# EAGLE design vactrolcrossfader (EAGLE 7.6.0)
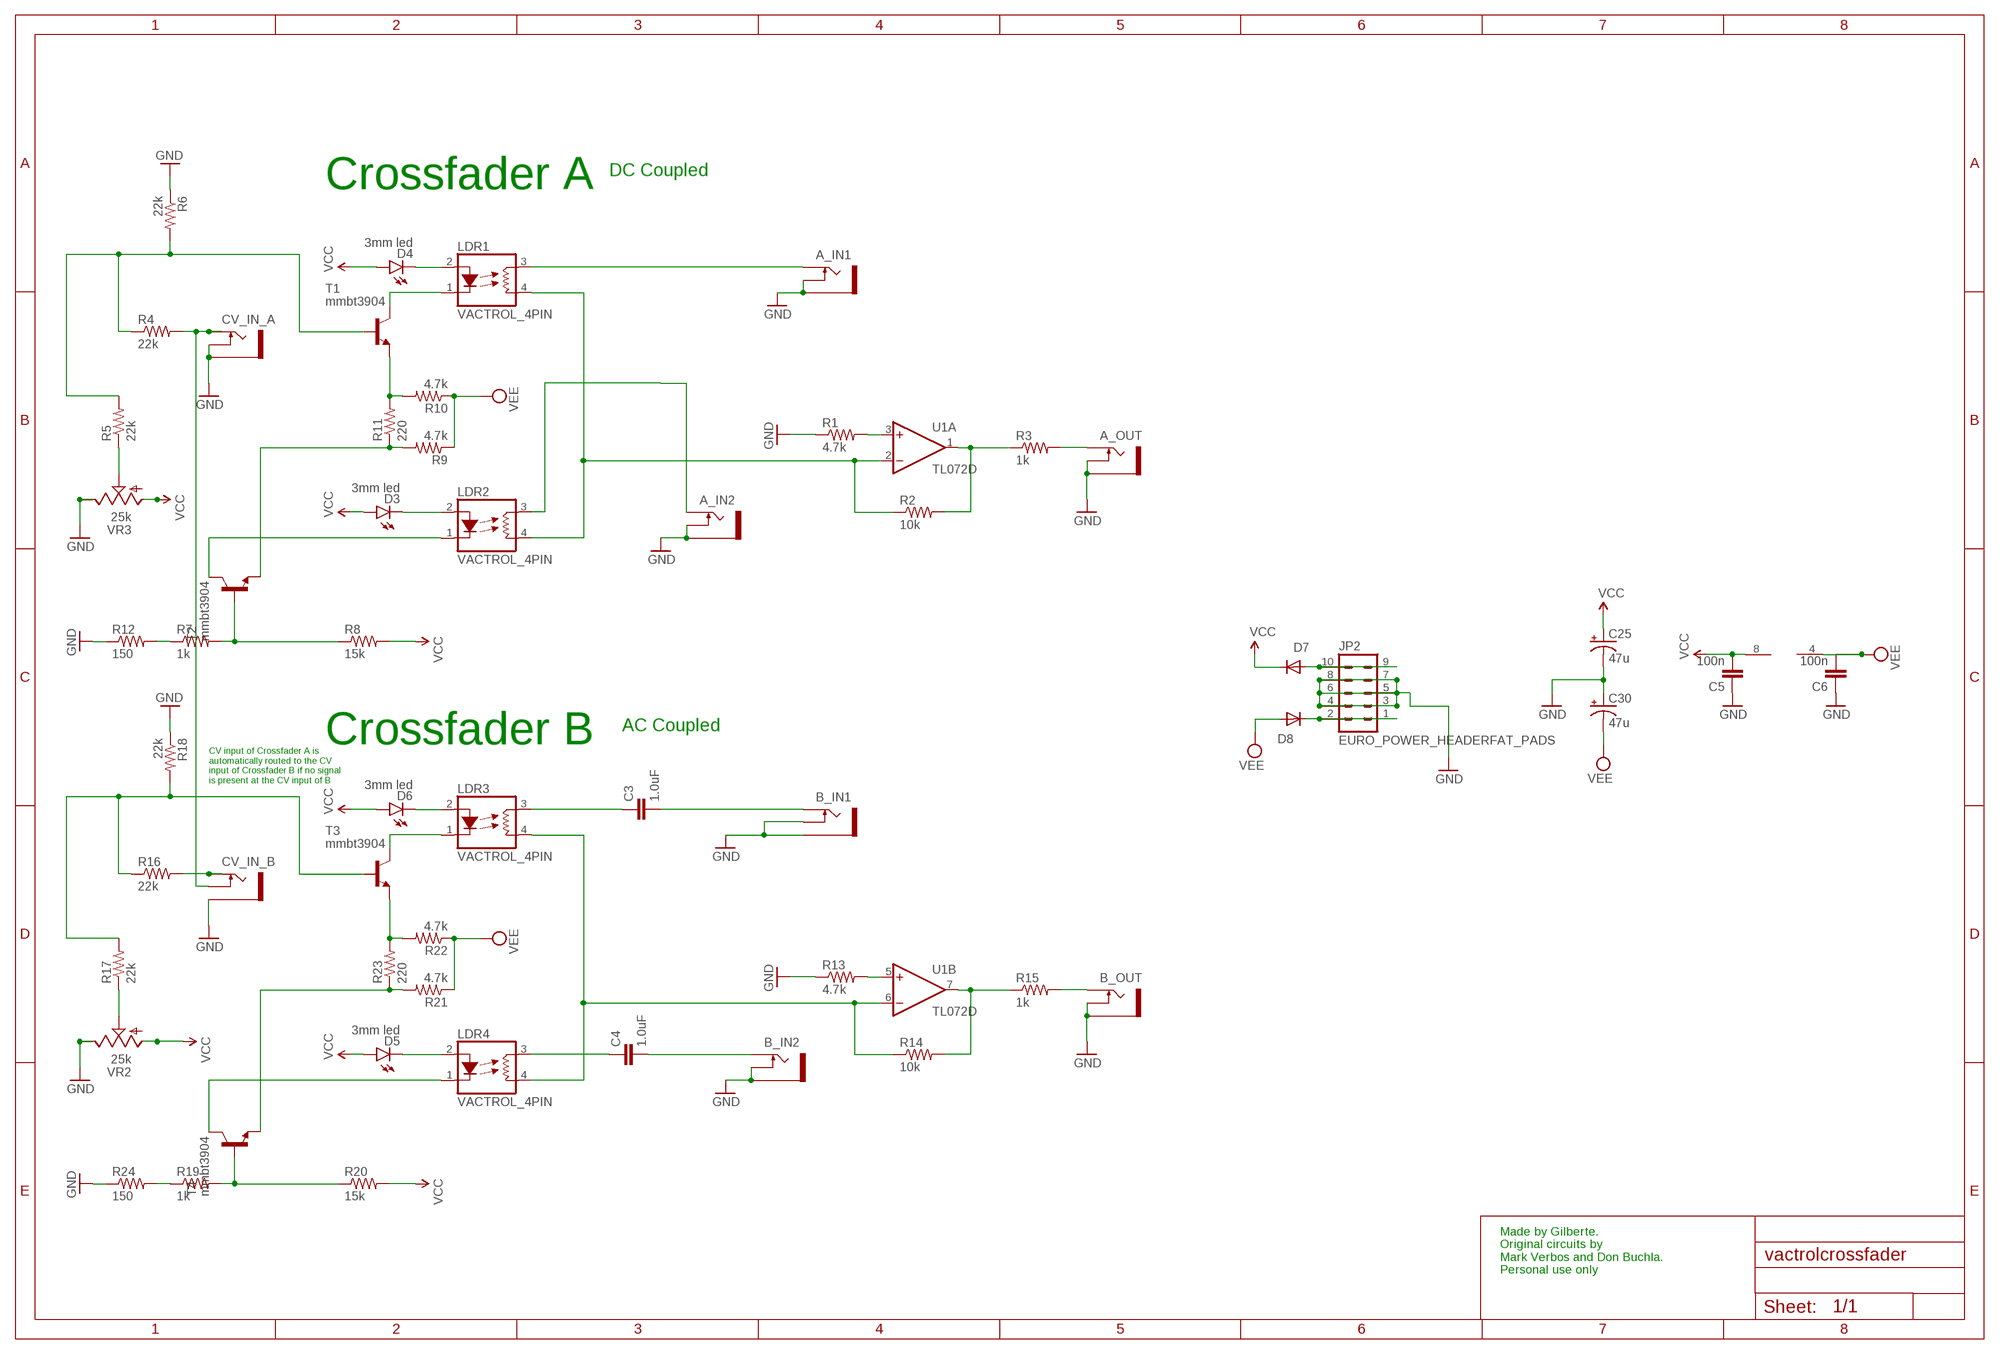
[diagram p0: schematic, sheet 1]

## Parts
A_IN1  THONKICONNNEW  [WQP-PJ301M-12_JACK]
A_IN2  THONKICONNNEW  [WQP-PJ301M-12_JACK]
A_OUT  THONKICONNNEW  [WQP-PJ301M-12_JACK]
B_IN1  THONKICONNNEW  [WQP-PJ301M-12_JACK]
B_IN2  THONKICONNNEW  [WQP-PJ301M-12_JACK]
B_OUT  THONKICONNNEW  [WQP-PJ301M-12_JACK]
C3  1.0uF  CAP0805  [0805]
C4  1.0uF  CAP0805  [0805]
C5  100n  CAP0805  [0805]
C6  100n  CAP0805  [0805]
C25  47u  CPOL-USD  [PANASONIC_D]
C30  47u  CPOL-USD  [PANASONIC_D]
CV_IN_A  THONKICONNNEW  [WQP-PJ301M-12_JACK]
CV_IN_B  THONKICONNNEW  [WQP-PJ301M-12_JACK]
D3  3mm led  LED3MM  [LED3MM]
D4  3mm led  LED3MM  [LED3MM]
D5  3mm led  LED3MM  [LED3MM]
D6  3mm led  LED3MM  [LED3MM]
D7  1N5819HW  DIODE-SOD123  [SOD123]
D8  1N5819HW  DIODE-SOD123  [SOD123]
JP2  EURO_POWER_HEADERFAT_PADS  [EURO_PWR_HEADER_FAT]
LDR1  VACTROL_4PIN  [VACTROL_4PIN_VTL5C]
LDR2  VACTROL_4PIN  [VACTROL_4PIN_VTL5C]
LDR3  VACTROL_4PIN  [VACTROL_4PIN_VTL5C]
LDR4  VACTROL_4PIN  [VACTROL_4PIN_VTL5C]
R1  4.7k  RESISTOR1206  [1206]
R2  10k  RESISTOR1206  [1206]
R3  1k  RESISTOR1206  [1206]
R4  22k  RESISTOR1206  [1206]
R5  22k  RESISTOR1206  [1206]
R6  22k  RESISTOR1206  [1206]
R7  1k  RESISTOR1206  [1206]
R8  15k  RESISTOR1206  [1206]
R9  4.7k  RESISTOR1206  [1206]
R10  4.7k  RESISTOR1206  [1206]
R11  220  RESISTOR1206  [1206]
R12  150  RESISTOR1206  [1206]
R13  4.7k  RESISTOR1206  [1206]
R14  10k  RESISTOR1206  [1206]
R15  1k  RESISTOR1206  [1206]
R16  22k  RESISTOR1206  [1206]
R17  22k  RESISTOR1206  [1206]
R18  22k  RESISTOR1206  [1206]
R19  1k  RESISTOR1206  [1206]
R20  15k  RESISTOR1206  [1206]
R21  4.7k  RESISTOR1206  [1206]
R22  4.7k  RESISTOR1206  [1206]
R23  220  RESISTOR1206  [1206]
R24  150  RESISTOR1206  [1206]
T1  mmbt3904  MMBT3904LT1-NPN-SOT23-BEC  [SOT23-BEC]
T2  mmbt3904  MMBT3904LT1-NPN-SOT23-BEC  [SOT23-BEC]
T3  mmbt3904  MMBT3904LT1-NPN-SOT23-BEC  [SOT23-BEC]
T4  mmbt3904  MMBT3904LT1-NPN-SOT23-BEC  [SOT23-BEC]
U1  TL072D  [SO08]
VR2  25k  9MM_SNAP-IN_POT_  [9MM_SNAP-IN_POT]
VR3  25k  9MM_SNAP-IN_POT_  [9MM_SNAP-IN_POT]

## Nets
GND: A_IN1.P$2_SWITCH(SWITCH) A_IN1.P$3_SLEEVE(SLEEVE) A_IN2.P$2_SWITCH(SWITCH) A_IN2.P$3_SLEEVE(SLEEVE) A_OUT.P$2_SWITCH(SWITCH) A_OUT.P$3_SLEEVE(SLEEVE) B_IN1.P$2_SWITCH(SWITCH) B_IN1.P$3_SLEEVE(SLEEVE) B_IN2.P$2_SWITCH(SWITCH) B_IN2.P$3_SLEEVE(SLEEVE) B_OUT.P$2_SWITCH(SWITCH) B_OUT.P$3_SLEEVE(SLEEVE) C5.1 C6.1 C25.- C30.+ CV_IN_A.P$2_SWITCH(SWITCH) CV_IN_A.P$3_SLEEVE(SLEEVE) CV_IN_B.P$3_SLEEVE(SLEEVE) JP2.3 JP2.4 JP2.5 JP2.6 JP2.7 JP2.8 R1.1 R6.1 R12.1 R13.1 R18.1 R24.1 VR2.3(E) VR3.3(E)
N$2: A_IN2.P$1_TIP(TIP) LDR2.3(RES1)
N$3: LDR1.4(RES2) LDR2.4(RES2) R2.1 U1.2(A:-IN)
N$4: R1.2 U1.3(A:+IN)
N$5: D3.K(C) LDR2.2(LED+)
N$7: LDR2.1(LED-) T2.C
N$8: R2.2 R3.1 U1.1(A:OUT)
N$9: A_OUT.P$1_TIP(TIP) R3.2
N$10: LDR1.1(LED-) T1.C
N$11: CV_IN_A.P$1_TIP(TIP) CV_IN_B.P$2_SWITCH(SWITCH) R4.2
N$12: R4.1 R5.2 R6.2 T1.B
N$13: R5.1 VR3.2(S)
N$14: A_IN1.P$1_TIP(TIP) LDR1.3(RES1)
N$15: R7.2 R8.1 T2.B
N$16: R9.2 R11.1 T2.E
N$17: R10.2 R11.2 T1.E
N$19: R7.1 R12.2
N$21: D4.K(C) LDR1.2(LED+)
N$25: LDR3.4(RES2) LDR4.4(RES2) R14.1 U1.6(B:-IN)
N$26: R13.2 U1.5(B:+IN)
N$27: R14.2 R15.1 U1.7(B:OUT)
N$28: B_OUT.P$1_TIP(TIP) R15.2
N$29: D5.K(C) LDR4.2(LED+)
N$30: LDR3.1(LED-) T3.C
N$31: CV_IN_B.P$1_TIP(TIP) R16.2
N$32: R16.1 R17.2 R18.2 T3.B
N$33: R17.1 VR2.2(S)
N$34: R19.2 R20.1 T4.B
N$35: R21.2 R23.1 T4.E
N$36: R22.2 R23.2 T3.E
N$37: LDR4.1(LED-) T4.C
N$38: R19.1 R24.2
N$39: D6.K(C) LDR3.2(LED+)
N$41: B_IN2.P$1_TIP(TIP) C4.2
N$42: B_IN1.P$1_TIP(TIP) C3.2
N$45: C3.1 LDR3.3(RES1)
N$46: C4.1 LDR4.3(RES1)
N$56: D8.C JP2.1 JP2.2
N$64: D7.A JP2.9 JP2.10
VCC: C5.2 C25.+ D3.A D4.A D5.A D6.A D7.C R8.2 R20.2 U1.8(P:V+) VR2.1(A) VR3.1(A)
VEE: C6.2 C30.- D8.A R9.1 R10.1 R21.1 R22.1 U1.4(P:V-)

## Notes on the sheet
- DC Coupled
- Crossfader A
- AC Coupled
- Crossfader B
- CV input of Crossfader A is 
  automatically routed to the CV 
  input of Crossfader B if no signal
  is present at the CV input of B
- Made by Gilberte. 
  Original circuits by 
  Mark Verbos and Don Buchla.
  Personal use only

## Library data of the parts
A_IN1 A_IN2 A_OUT B_IN1 B_IN2 B_OUT CV_IN_A CV_IN_B = MusicThingModular:THONKICONN: 3.5mm socket for Eurorack modular synths
C3-C6 = SparkFun-Passives:CAP: Capacitor Standard 0603 ceramic capacitor, and 0.1" leaded capacitor.
C25 C30 = rcl:CPOL-US: POLARIZED CAPACITOR, American symbol
D3-D6 = SparkFun-LED:LED: LEDs Standard schematic elements and footprints for 5mm, 3mm, 1206, and 0603 sized LEDs. 5mm - Spark Fun Electronics SKU : COM-00529 (and others); PROD_ID: DIO-08794
D7 D8 = diode:DIODE-: DIODE
JP2 = MusicThingModular:EURO_POWER_HEADER: Power Header 10 pin power header for Eurorack Power Supplies Variants with fatter pads for easier soldering, and the LOCK variant which has 5mil offset pins to hold the component in place before soldering
LDR1-LDR4 = MusicThingModular:VACTROL_4PIN: 4 Pin Vactrol Resistive Photocoupler
R1-R24 = SparkFun-Passives:RESISTOR: Resistor Basic schematic elements and footprints for 0603, 1206, and PTH resistors.
T1-T4 = MusicThingModular:*-NPN-: NPN Transistror BF959 corrected 2008.03.06
U1 = linear:TL072: OP AMP
VR2 VR3 = MusicThingModular:9MM_SNAP-IN_POT: 9mm vertical snap-in pot, Alpha / Panasonic style

## Board
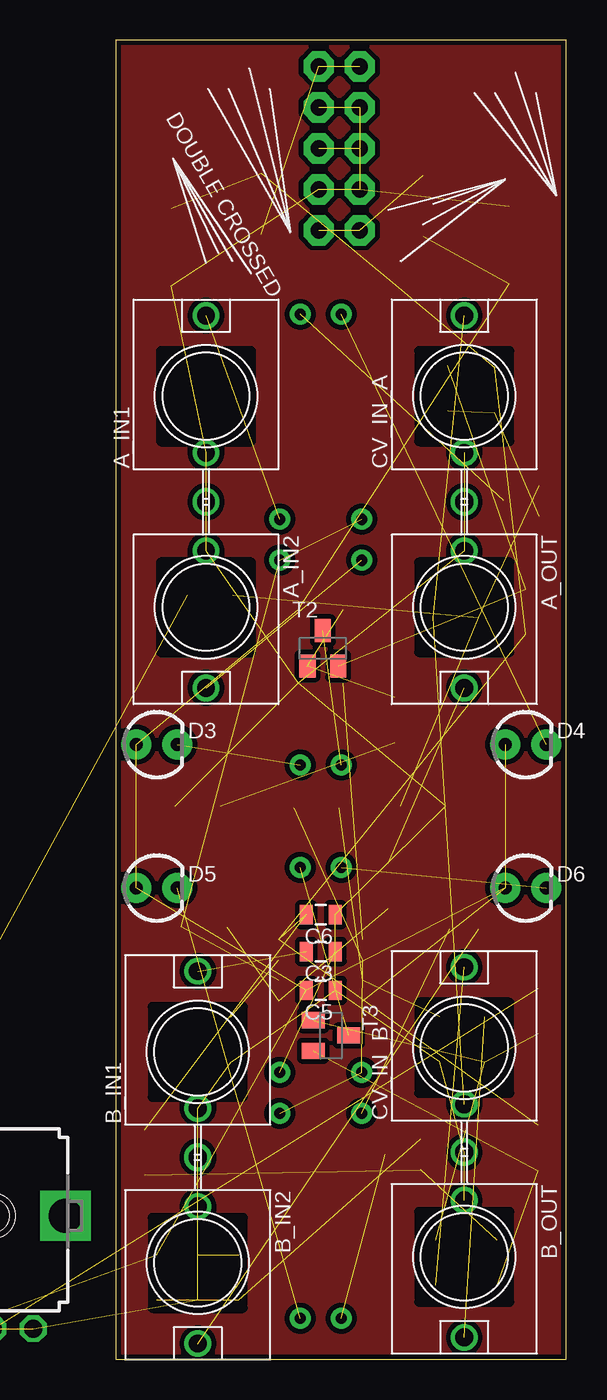
[diagram p1: board, top side]
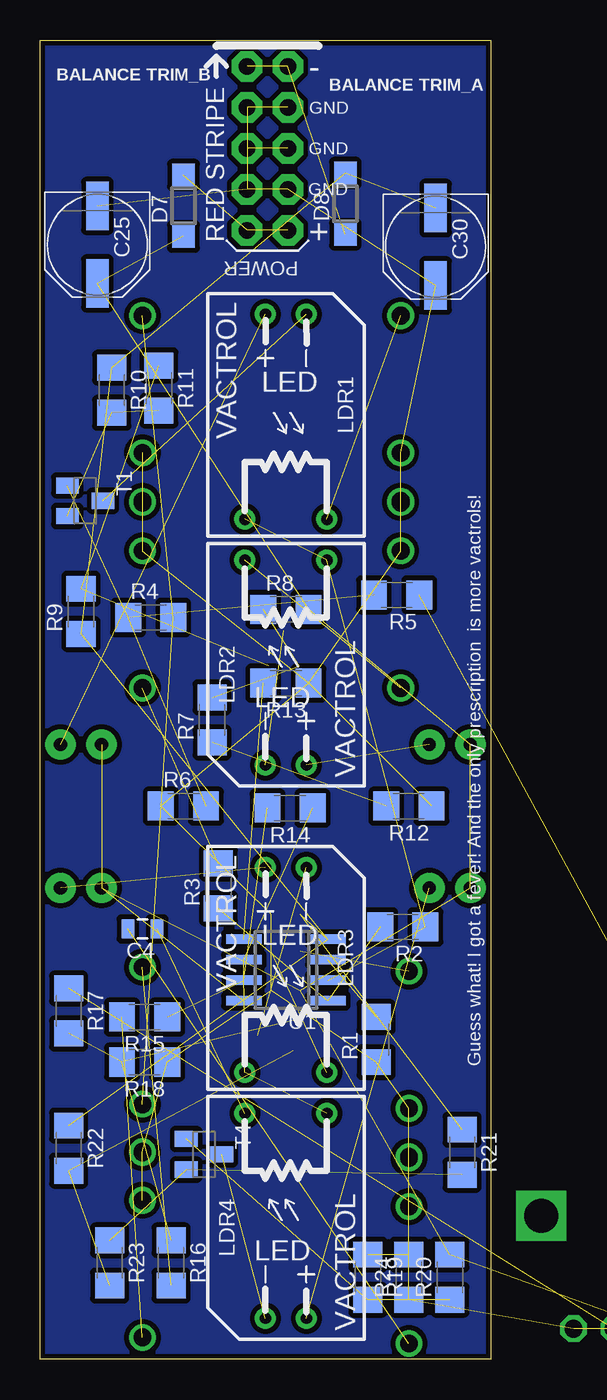
[diagram p2: board, bottom side, seen from below]

Size 27.92 x 81.76 mm. Coordinates in mm from the lower left corner, seen from the top.
Outline: 0,81.76 0,0 27.92,0 27.92,81.76 0,81.76
Copper layers (1*16): Top 0.035mm / dielectric 1.5mm / Bottom 0.035mm
Design rules "SparkFun-2-layer-TIGHT": minimum track width 7mil, minimum drill 15mil, track to track 7mil, track to pad 7mil, pad to pad 7mil, via to via 7mil, smd to smd 7mil, copper to edge 7mil, drill to drill 7mil, minimum pad ring 7mil, minimum via ring 7mil, stop-mask expansion 4mil, vias tented up to drill 25mil, thermal gap 10mil

### Footprints (pad centres in the part's own frame; a part is rotated, then mirrored left to right if it is on the bottom)
WQP-PJ301M-12_JACK = drill 1.1: P$1_TIP 0,5; P$2_SWITCH 0,-3.5; P$3_SLEEVE 0,-6.5
0805 = smd 0.8 x 1.2: 1 -0.9,0; 2 0.9,0
PANASONIC_D = smd 3 x 1.4: + 2.4,0; - -2.4,0
LED3MM = drill 0.813 pad 1.88: A -1.27,0; K 1.27,0
SOD123 = smd 1.4 x 1.4: A 1.9,0; C -1.9,0
EURO_PWR_HEADER_FAT = drill 1.016 pad 1.88 octagon: 1 -5.08,-1.27; 2 -5.08,1.27; 3 -2.54,-1.27; 4 -2.54,1.27; 5 0,-1.27; 6 0,1.27; 7 2.54,-1.27; 8 2.54,1.27; 9 5.08,-1.27; 10 5.08,1.27
VACTROL_4PIN_VTL5C = drill 0.7 pad 1.3: 1 -6.35,1.27; 2 -6.35,-1.27; 3 6.35,2.54; 4 6.35,-2.54
1206 = smd 1.6 x 1.8: 1 -1.4,0; 2 1.4,0
SOT23-BEC = smd 1 x 1.4: B -0.95,-1.1; C 0,1.1; E 0.95,-1.1
SO08 = smd 0.6 x 2.2: 1 -1.905,-2.6; 2 -0.635,-2.6; 3 0.635,-2.6; 4 1.905,-2.6; 5 1.905,2.6; 6 0.635,2.6; 7 -0.635,2.6; 8 -1.905,2.6
9MM_SNAP-IN_POT = drill 1.1 square: 1 -2.5,-7 | drill 1.1 octagon: 2 0,-7; 3 2.5,-7 | drill 2.1 square: CHASSIS1 -4.5,0; CHASSIS2 4.5,0

### Placement (x,y rotation side)
A_IN1  5.59,59.69 0 top
A_IN2  5.59,46.61 180 top
A_OUT  21.59,46.61 180 top
B_IN1  5.08,19.05 0 top
B_IN2  5.08,5.97 180 top
B_OUT  21.59,6.35 180 top
C3  12.7,25.27 180 top
C4  21.59,26.67 180 bottom
C5  12.7,22.86 180 top
C6  12.7,27.56 180 top
C25  24.38,69.09 270 bottom
C30  3.43,68.96 270 bottom
CV_IN_A  21.59,59.69 0 top
CV_IN_B  21.59,19.3 0 top
D3  2.54,38.1 0 top
D4  25.4,38.1 0 top
D5  2.54,29.21 0 top
D6  25.4,29.21 0 top
D7  19.05,71.5 90 bottom
D8  9.02,71.63 90 bottom
JP2  13.84,75.06 270 bottom
LDR1  12.7,58.42 270 bottom
LDR2  12.7,43.18 90 bottom
LDR3  12.7,24.13 270 bottom
LDR4  12.7,8.89 90 bottom
R1  7.11,19.81 90 bottom
R2  5.46,26.8 180 bottom
R3  16.89,29.34 90 bottom
R4  21.08,45.97 0 bottom
R5  5.84,47.37 180 bottom
R6  19.05,34.29 0 bottom
R7  17.27,39.62 90 bottom
R8  12.7,46.48 0 bottom
R9  25.4,46.35 90 bottom
R10  23.5,60.07 270 bottom
R11  20.57,60.2 270 bottom
R12  5.08,34.29 180 bottom
R13  12.7,41.91 180 bottom
R14  12.45,34.16 180 bottom
R15  21.46,21.21 180 bottom
R16  19.81,5.97 270 bottom
R17  26.16,21.59 270 bottom
R18  21.46,18.41 180 bottom
R19  7.62,5.08 270 bottom
R20  2.54,5.08 90 bottom
R21  1.78,12.83 270 bottom
R22  26.16,13.08 270 bottom
R23  23.62,5.97 270 bottom
R24  5.08,5.08 90 bottom
T1  25.15,53.21 270 bottom
T2  12.83,44.07 0 top
T3  13.34,20.07 270 top
T4  17.78,12.7 270 bottom
U1  12.7,24.13 90 bottom
VR2  -7.62,8.89 0 top  (outside the outline)
VR3  -20.32,8.89 0 top  (outside the outline)

### Tracks (layer width: path | path; a pad name or v marks a point on that pad's centre or on a via)
GND  (32 unrouted)
N$1
  pour Top (isolate 0.305): 27.94,0 27.94,82.04 0,82.04 0,0
N$2  (1 unrouted)
N$3  (3 unrouted)
N$4  (1 unrouted)
N$5  (1 unrouted)
N$6
  pour Bottom (isolate 0.305): 0,82.04 27.94,82.04 27.94,0 0,0
N$7  (1 unrouted)
N$8  (2 unrouted)
N$9  (1 unrouted)
N$10  (1 unrouted)
N$11  (2 unrouted)
N$12  (3 unrouted)
N$13  (1 unrouted)
N$14  (1 unrouted)
N$15  (2 unrouted)
N$16  (2 unrouted)
N$17  (2 unrouted)
N$19  (1 unrouted)
N$21  (1 unrouted)
N$25  (3 unrouted)
N$26  (1 unrouted)
N$27  (2 unrouted)
N$28  (1 unrouted)
N$29  (1 unrouted)
N$30  (1 unrouted)
N$31  (1 unrouted)
N$32  (3 unrouted)
N$33  (1 unrouted)
N$34  (2 unrouted)
N$35  (2 unrouted)
N$36  (2 unrouted)
N$37  (1 unrouted)
N$38  (1 unrouted)
N$39  (1 unrouted)
N$41  (1 unrouted)
N$42  (1 unrouted)
N$45  (1 unrouted)
N$46  (1 unrouted)
N$56  (2 unrouted)
N$64  (2 unrouted)
VCC  (11 unrouted)
VEE  (7 unrouted)

### Text on the board
tNames: DOUBLE CROSSED
bNames: BALANCE TRIM_A | BALANCE TRIM_B | Guess what! I got a fever! And the only prescription is more vactrols!
tStop: Designed in / København, / Denmark 2016. | Vactrol crossfader by / Mads Kjeldgaard. V1.2 | Inspired by: / Don Buchla& / Mark Verbos& / Olivier Gillet& / Tom Whitwell& / Pusherman